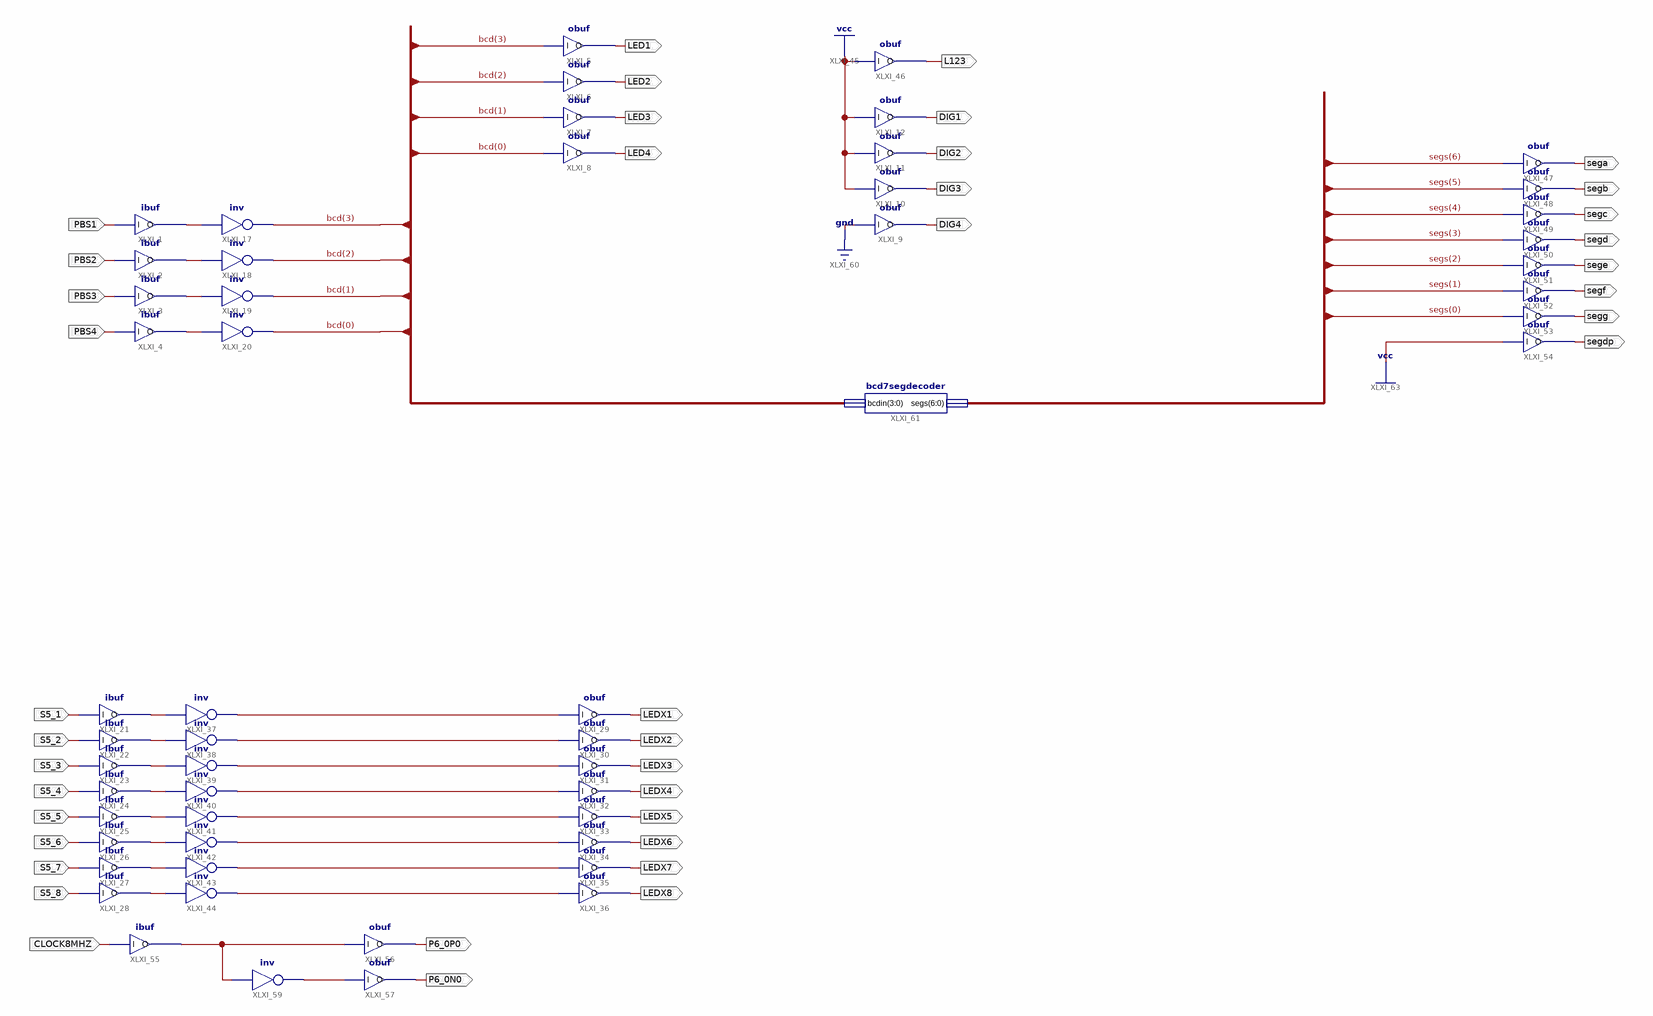
[diagram p0: schematic sheet 1]
// Xilinx ISE schematic bcd7seg.sch (spartan6) as structural Verilog: 54 symbols, 40 ports
module bcd7seg (
  input  PBS1,
  input  PBS2,
  input  PBS3,
  input  PBS4,
  input  CLOCK8MHZ,
  input  S5_1,
  input  S5_2,
  input  S5_3,
  input  S5_4,
  input  S5_5,
  input  S5_6,
  input  S5_7,
  input  S5_8,
  output DIG1,
  output DIG2,
  output DIG3,
  output DIG4,
  output L123,
  output LED1,
  output LED2,
  output LED3,
  output LED4,
  output sega,
  output segb,
  output segc,
  output segd,
  output sege,
  output segf,
  output segg,
  output segdp,
  output P6_0P0,
  output P6_0N0,
  output LEDX1,
  output LEDX2,
  output LEDX3,
  output LEDX4,
  output LEDX5,
  output LEDX6,
  output LEDX7,
  output LEDX8
);

  wire XLXN_1, XLXN_14, XLXN_15, XLXN_16, XLXN_65, XLXN_66, XLXN_67, XLXN_68, XLXN_69, XLXN_70, XLXN_71,
       XLXN_72, XLXN_77, XLXN_81, XLXN_105, XLXN_106, XLXN_107, XLXN_108, XLXN_109, XLXN_111, XLXN_112,
       XLXN_113;
  wire [3:0] bcd;
  wire [6:0] segs;

  bcd7segdecoder XLXI_61 (.bcdin(bcd), .segs(segs));
  ibuf XLXI_1 (.I(PBS1), .O(XLXN_1));
  ibuf XLXI_2 (.I(PBS2), .O(XLXN_14));
  ibuf XLXI_3 (.I(PBS3), .O(XLXN_15));
  ibuf XLXI_4 (.I(PBS4), .O(XLXN_16));
  not XLXI_17 (bcd[3], XLXN_1);
  not XLXI_18 (bcd[2], XLXN_14);
  not XLXI_19 (bcd[1], XLXN_15);
  not XLXI_20 (bcd[0], XLXN_16);
  obuf XLXI_9 (.I(1'b0), .O(DIG4));
  obuf XLXI_10 (.I(1'b1), .O(DIG3));
  obuf XLXI_11 (.I(1'b1), .O(DIG2));
  obuf XLXI_12 (.I(1'b1), .O(DIG1));
  obuf XLXI_46 (.I(1'b1), .O(L123));
  obuf XLXI_5 (.I(bcd[3]), .O(LED1));
  obuf XLXI_6 (.I(bcd[2]), .O(LED2));
  obuf XLXI_7 (.I(bcd[1]), .O(LED3));
  obuf XLXI_8 (.I(bcd[0]), .O(LED4));
  obuf XLXI_47 (.I(segs[6]), .O(sega));
  obuf XLXI_48 (.I(segs[5]), .O(segb));
  obuf XLXI_49 (.I(segs[4]), .O(segc));
  obuf XLXI_50 (.I(segs[3]), .O(segd));
  obuf XLXI_51 (.I(segs[2]), .O(sege));
  obuf XLXI_52 (.I(segs[1]), .O(segf));
  obuf XLXI_53 (.I(segs[0]), .O(segg));
  obuf XLXI_54 (.I(1'b1), .O(segdp));
  obuf XLXI_56 (.I(XLXN_81), .O(P6_0P0));
  obuf XLXI_57 (.I(XLXN_77), .O(P6_0N0));
  not XLXI_59 (XLXN_77, XLXN_81);
  ibuf XLXI_55 (.I(CLOCK8MHZ), .O(XLXN_81));
  ibuf XLXI_21 (.I(S5_1), .O(XLXN_65));
  ibuf XLXI_22 (.I(S5_2), .O(XLXN_66));
  ibuf XLXI_23 (.I(S5_3), .O(XLXN_67));
  ibuf XLXI_24 (.I(S5_4), .O(XLXN_68));
  ibuf XLXI_25 (.I(S5_5), .O(XLXN_69));
  ibuf XLXI_26 (.I(S5_6), .O(XLXN_70));
  ibuf XLXI_27 (.I(S5_7), .O(XLXN_71));
  ibuf XLXI_28 (.I(S5_8), .O(XLXN_72));
  not XLXI_37 (XLXN_105, XLXN_65);
  not XLXI_38 (XLXN_106, XLXN_66);
  not XLXI_39 (XLXN_107, XLXN_67);
  not XLXI_40 (XLXN_108, XLXN_68);
  not XLXI_41 (XLXN_109, XLXN_69);
  not XLXI_42 (XLXN_112, XLXN_70);
  not XLXI_43 (XLXN_111, XLXN_71);
  not XLXI_44 (XLXN_113, XLXN_72);
  obuf XLXI_29 (.I(XLXN_105), .O(LEDX1));
  obuf XLXI_30 (.I(XLXN_106), .O(LEDX2));
  obuf XLXI_31 (.I(XLXN_107), .O(LEDX3));
  obuf XLXI_32 (.I(XLXN_108), .O(LEDX4));
  obuf XLXI_33 (.I(XLXN_109), .O(LEDX5));
  obuf XLXI_34 (.I(XLXN_112), .O(LEDX6));
  obuf XLXI_35 (.I(XLXN_111), .O(LEDX7));
  obuf XLXI_36 (.I(XLXN_113), .O(LEDX8));
endmodule
